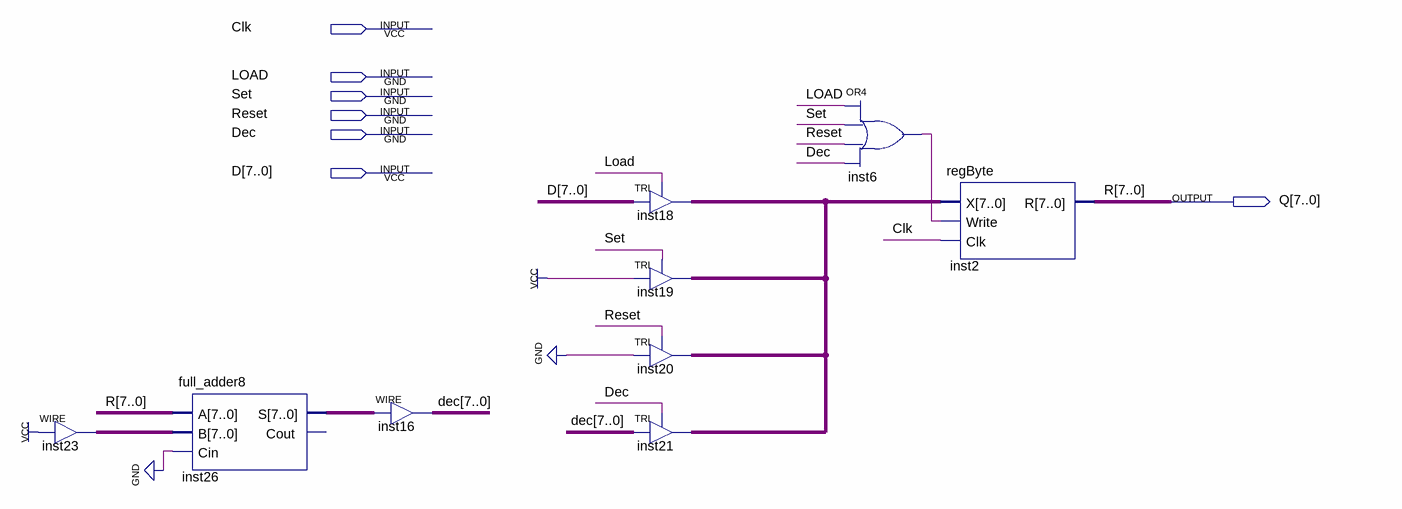
[diagram p0: schematic sheet]
// Quartus schematic unireg_dec.bdf as structural Verilog: 9 symbols, 7 pins
module unireg_dec (
  input  Clk,
  input  LOAD,
  input  Set,
  input  Reset,
  input  Dec,
  input  [7:0] D,
  output [7:0] Q
);

  wire inst6_out;
  wire [7:0] Dec_bus, inst18_out, inst23_out, inst26_s;

  assign inst23_out = {8{1'b1}};  // WIRE inst23
  full_adder8 inst26 (.A(Q), .B(inst23_out), .Cin(1'b0), .S(inst26_s));  // open: Cout
  assign Dec_bus = inst26_s;  // WIRE inst16
  TRI inst18[7:0] (.IN(D), .OE(LOAD), .OUT(inst18_out));
  TRI inst19[7:0] (.IN(1'b1), .OE(Set), .OUT(inst18_out));
  TRI inst20[7:0] (.IN(1'b0), .OE(Reset), .OUT(inst18_out));
  TRI inst21[7:0] (.IN(Dec_bus), .OE(Dec), .OUT(inst18_out));
  or inst6 (inst6_out, LOAD, Set, Reset, Dec);
  regByte inst2 (.X(inst18_out), .Write(inst6_out), .Clk(Clk), .R(Q));

  // Other names for the same wires on the sheet: R[7:0] = Q
endmodule
